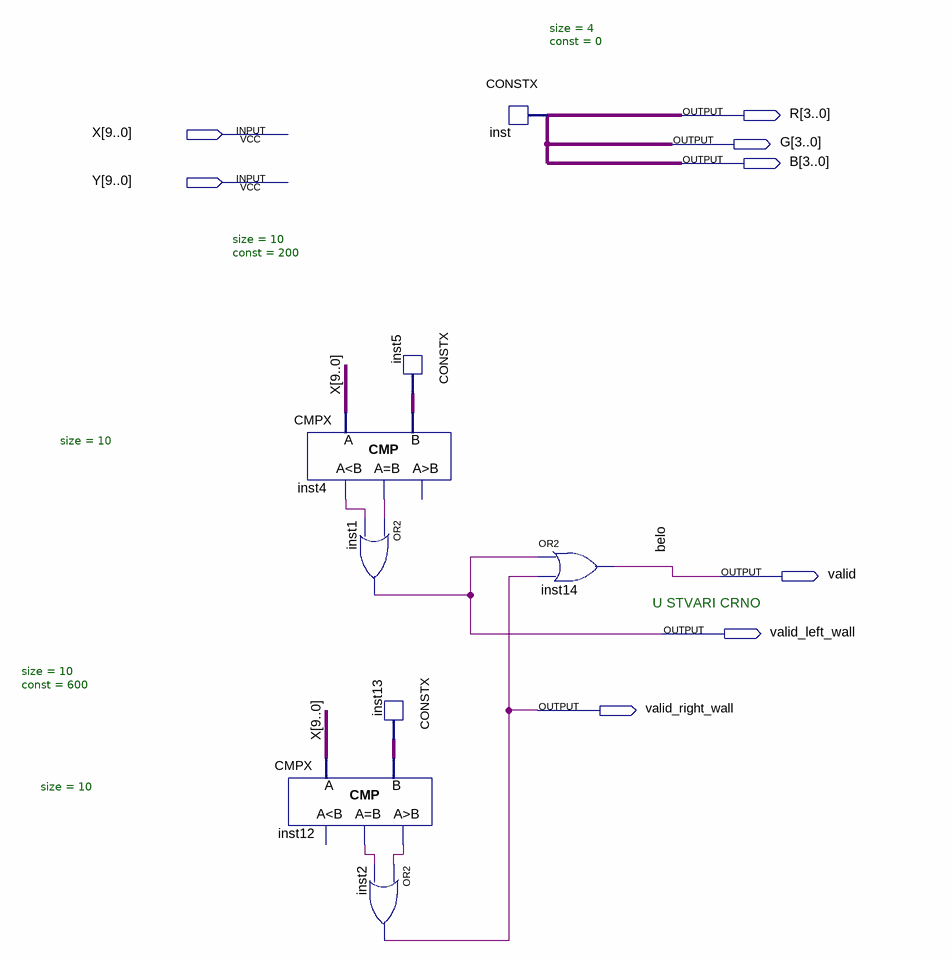
[diagram p0: schematic sheet]
// Quartus schematic Layer0.bdf as structural Verilog: 8 symbols, 8 pins
module Layer0 (
  input  [9:0] X,
  input  [9:0] Y,
  output [3:0] R,
  output [3:0] G,
  output [3:0] B,
  output valid,
  output valid_left_wall,
  output valid_right_wall
);

  wire inst4_eq, inst4_ls, inst12_eq, inst12_gr;
  wire [9:0] inst5_data, inst13_data;

  CMPX #(.size(10)) inst12 (.A(X), .B(inst13_data), .eq(inst12_eq), .gr(inst12_gr));  // open: ls
  CMPX #(.size(10)) inst4 (.A(X), .B(inst5_data), .ls(inst4_ls), .eq(inst4_eq));  // open: gr
  or inst1 (valid_left_wall, inst4_eq, inst4_ls);
  or inst2 (valid_right_wall, inst12_gr, inst12_eq);
  CONSTX #(.size(10), .\const (200)) inst5 (.data(inst5_data));
  CONSTX #(.size(10), .\const (600)) inst13 (.data(inst13_data));
  CONSTX #(.size(4), .\const (0)) inst (.data(B));
  or inst14 (valid, valid_left_wall, valid_right_wall);

  assign G = B;
  assign R = B;

  // Other names for the same wires on the sheet: belo = valid

  // Notes on the sheet:
  //   U STVARI CRNO
endmodule
